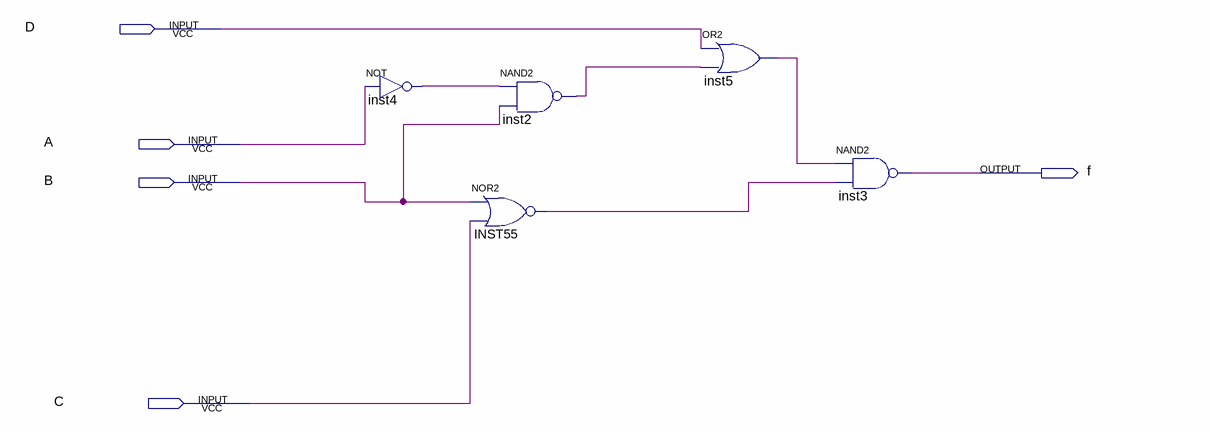
[diagram p0: schematic sheet]
// Quartus schematic Lab2.bdf as structural Verilog: 5 symbols, 5 pins
module Lab2 (
  input  D,
  input  A,
  input  B,
  input  C,
  output f
);

  wire inst2_out, inst4_out, inst5_out, INST55_out;

  not inst4 (inst4_out, A);
  nand inst2 (inst2_out, inst4_out, B);
  nor INST55 (INST55_out, B, C);
  or inst5 (inst5_out, D, inst2_out);
  nand inst3 (f, inst5_out, INST55_out);
endmodule
